# EAGLE schematic INV_H (EAGLE 9.6.2)
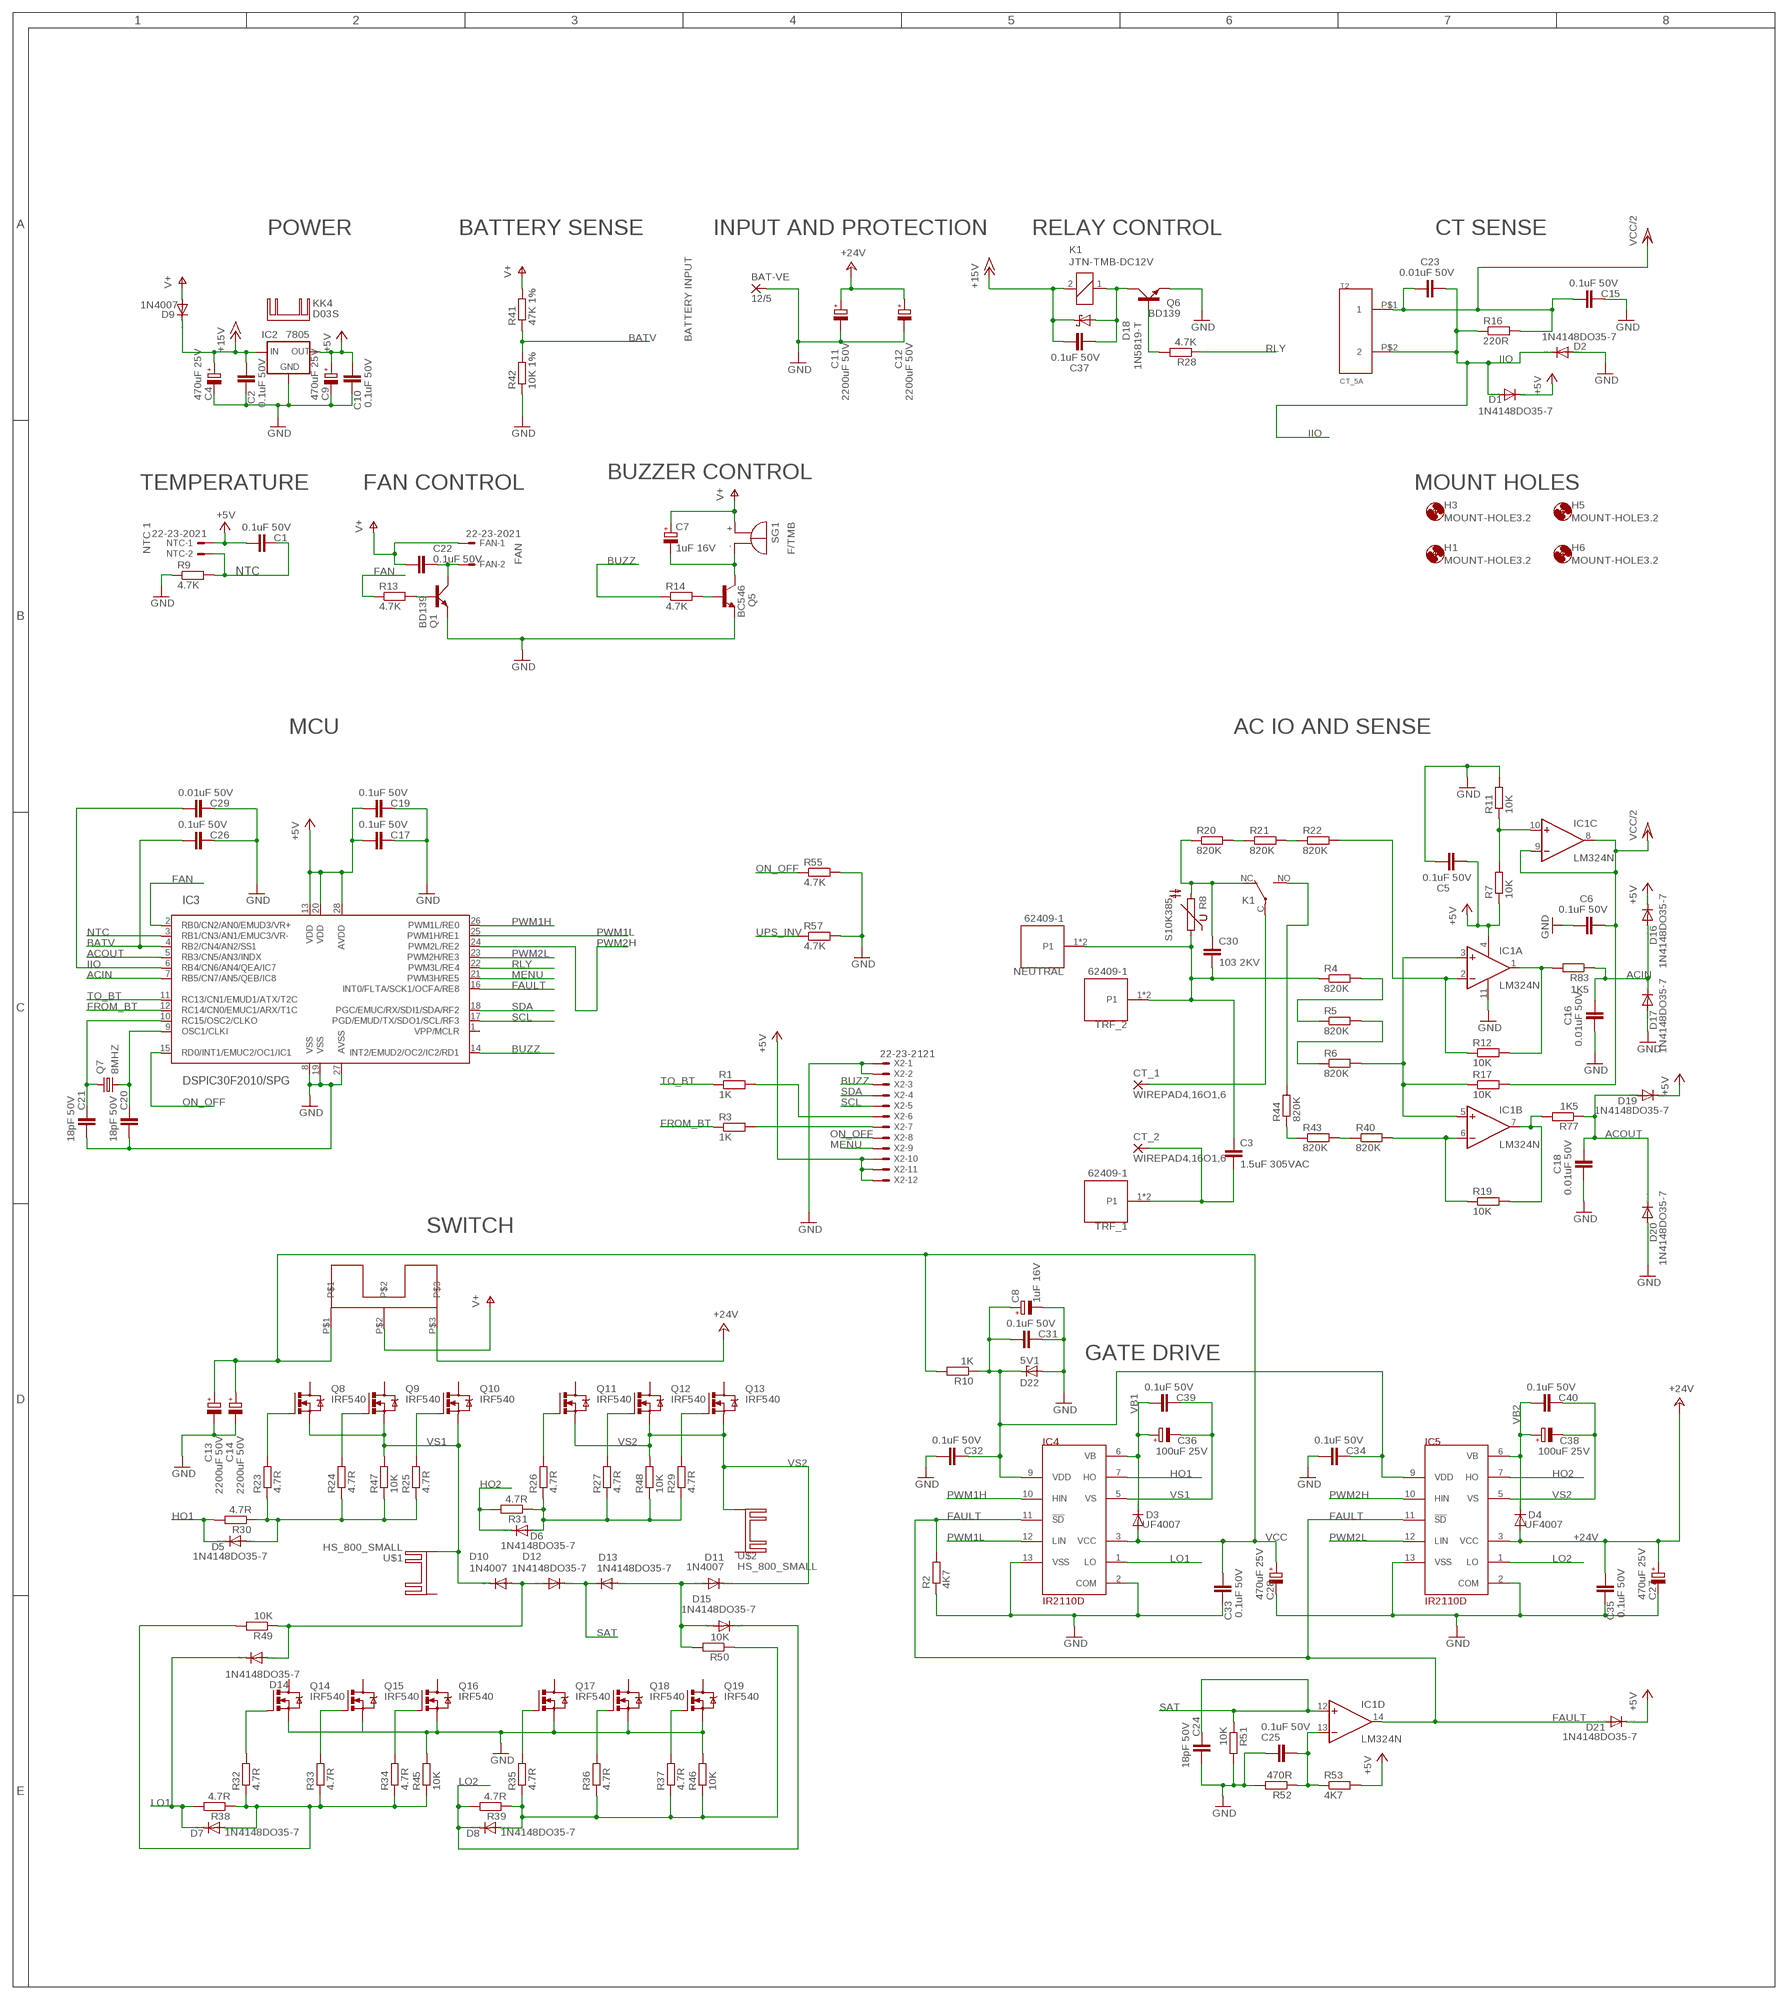
[diagram p0: schematic, sheet 1]

## Parts
BAT-VE  12/5  [8/5]
C1  0.1uF 50V  C-EU025-025X050  [C025-025X050]
C2  0.1uF 50V  C-EU025-025X050  [C025-025X050]
C3  1.5uF 305VAC  C-EU275-113X316  [C275-113X316]
C4  470uF 25V  CPOL-EUE3.5-8  [E3,5-8]
C5  0.1uF 50V  C-EU025-025X050  [C025-025X050]
C6  0.1uF 50V  C-EU025-025X050  [C025-025X050]
C7  1uF 16V  CPOL-EUE1.8-4  [E1,8-4]
C8  1uF 16V  CPOL-EUE1.8-4  [E1,8-4]
C9  470uF 25V  CPOL-EUE3.5-8  [E3,5-8]
C10  0.1uF 50V  C-EU025-025X050  [C025-025X050]
C11  2200uF 50V  CPOL-EUE7.5-16  [E7,5-16]
C12  2200uF 50V  CPOL-EUE7.5-16  [E7,5-16]
C13  2200uF 50V  CPOL-EUE7.5-16  [E7,5-16]
C14  2200uF 50V  CPOL-EUE7.5-16  [E7,5-16]
C15  0.1uF 50V  C-EU025-025X050  [C025-025X050]
C16  0.01uF 50V  C-EU025-025X050  [C025-025X050]
C17  0.1uF 50V  C-EU025-025X050  [C025-025X050]
C18  0.01uF 50V  C-EU025-025X050  [C025-025X050]
C19  0.1uF 50V  C-EU025-025X050  [C025-025X050]
C20  18pF 50V  C-EU025-025X050  [C025-025X050]
C21  18pF 50V  C-EU025-025X050  [C025-025X050]
C22  0.1uF 50V  C-EU025-025X050  [C025-025X050]
C23  0.01uF 50V  C-EU025-025X050  [C025-025X050]
C24  18pF 50V  C-EU025-025X050  [C025-025X050]
C25  0.1uF 50V  C-EU025-025X050  [C025-025X050]
C26  0.1uF 50V  C-EU025-025X050  [C025-025X050]
C27  470uF 25V  CPOL-EUE3.5-8  [E3,5-8]
C28  470uF 25V  CPOL-EUE3.5-8  [E3,5-8]
C29  0.01uF 50V  C-EU025-025X050  [C025-025X050]
C30  103 2KV  C-EU075-032X103  [C075-032X103]
C31  0.1uF 50V  C-EU025-025X050  [C025-025X050]
C32  0.1uF 50V  C-EU025-025X050  [C025-025X050]
C33  0.1uF 50V  C-EU025-025X050  [C025-025X050]
C34  0.1uF 50V  C-EU025-025X050  [C025-025X050]
C35  0.1uF 50V  C-EU025-025X050  [C025-025X050]
C36  100uF 25V  CPOL-EUE2.5-6  [E2,5-6]
C37  0.1uF 50V  C-EU025-025X050  [C025-025X050]
C38  100uF 25V  CPOL-EUE2.5-6  [E2,5-6]
C39  0.1uF 50V  C-EU025-025X050  [C025-025X050]
C40  0.1uF 50V  C-EU025-025X050  [C025-025X050]
CT_1  WIREPAD4,16O1,6  [4,16O1,6]
CT_2  WIREPAD4,16O1,6  [4,16O1,6]
D1  1N4148DO35-7  [DO35-7]
D2  1N4148DO35-7  [DO35-7]
D3  UF4007  1N4004  [DO41-10]
D4  UF4007  1N4004  [DO41-10]
D5  1N4148DO35-7  [DO35-7]
D6  1N4148DO35-7  [DO35-7]
D7  1N4148DO35-7  [DO35-7]
D8  1N4148DO35-7  [DO35-7]
D9  1N4007  1N4004  [DO41-10]
D10  1N4007  1N4004  [DO41-10]
D11  1N4007  1N4004  [DO41-10]
D12  1N4148DO35-7  [DO35-7]
D13  1N4148DO35-7  [DO35-7]
D14  1N4148DO35-7  [DO35-7]
D15  1N4148DO35-7  [DO35-7]
D16  1N4148DO35-7  [DO35-7]
D17  1N4148DO35-7  [DO35-7]
D18  1N5819-T  [DO41-7.6]
D19  1N4148DO35-7  [DO35-7]
D20  1N4148DO35-7  [DO35-7]
D21  1N4148DO35-7  [DO35-7]
D22  5V1  ZENER-DIODEDO34-7  [DO34Z7]
FAN  22-23-2021  [22-23-2021]
H1  MOUNT-HOLE3.2  [3,2]
H3  MOUNT-HOLE3.2  [3,2]
H5  MOUNT-HOLE3.2  [3,2]
H6  MOUNT-HOLE3.2  [3,2]
IC1  LM324N  [DIL14]
IC2  7805  78XXS  [78XXS]
IC3  DSPIC30F2010/SPG  [DIL28-3]
IC4  IR2110D  [DIL14]
IC5  IR2110D  [DIL14]
K1  JTN-TMB-DC12V  [JT-TMB]
KK4  D03S  [D03S]
KK5  HS_800_BIG  [800W_BIG]
NEUTRAL  62409-1  [TE_62409-1]
NTC  22-23-2021  [22-23-2021]
Q1  BD139  [TO126AV]
Q5  BC546  BC548  [TO92-EBC]
Q6  BD139  [TO126AV]
Q7  8MHZ  CRYSTALHC49S  [HC49/S]
Q8  IRF540  [TO220BV]
Q9  IRF540  [TO220BV]
Q10  IRF540  [TO220BV]
Q11  IRF540  [TO220BV]
Q12  IRF540  [TO220BV]
Q13  IRF540  [TO220BV]
Q14  IRF540  [TO220BV]
Q15  IRF540  [TO220BV]
Q16  IRF540  [TO220BV]
Q17  IRF540  [TO220BV]
Q18  IRF540  [TO220BV]
Q19  IRF540  [TO220BV]
R1  1K  R-EU_0204/7  [0204/7]
R2  4K7  R-EU_0204/7  [0204/7]
R3  1K  R-EU_0204/7  [0204/7]
R4  820K  R-EU_0204/7  [0204/7]
R5  820K  R-EU_0204/7  [0204/7]
R6  820K  R-EU_0204/7  [0204/7]
R7  10K  R-EU_0204/7  [0204/7]
R8  S10K385  [S10K385]
R9  4.7K  R-EU_0204/7  [0204/7]
R10  1K  R-EU_0204/7  [0204/7]
R11  10K  R-EU_0204/7  [0204/7]
R12  10K  R-EU_0204/7  [0204/7]
R13  4.7K  R-EU_0204/7  [0204/7]
R14  4.7K  R-EU_0204/7  [0204/7]
R16  220R  R-EU_0204/7  [0204/7]
R17  10K  R-EU_0204/7  [0204/7]
R19  10K  R-EU_0204/7  [0204/7]
R20  820K  R-EU_0204/7  [0204/7]
R21  820K  R-EU_0204/7  [0204/7]
R22  820K  R-EU_0204/7  [0204/7]
R23  4.7R  R-EU_0204/7  [0204/7]
R24  4.7R  R-EU_0204/7  [0204/7]
R25  4.7R  R-EU_0204/7  [0204/7]
R26  4.7R  R-EU_0204/7  [0204/7]
R27  4.7R  R-EU_0204/7  [0204/7]
R28  4.7K  R-EU_0204/7  [0204/7]
R29  4.7R  R-EU_0204/7  [0204/7]
R30  4.7R  R-EU_0204/7  [0204/7]
R31  4.7R  R-EU_0204/7  [0204/7]
R32  4.7R  R-EU_0204/7  [0204/7]
R33  4.7R  R-EU_0204/7  [0204/7]
R34  4.7R  R-EU_0204/7  [0204/7]
R35  4.7R  R-EU_0204/7  [0204/7]
R36  4.7R  R-EU_0204/7  [0204/7]
R37  4.7R  R-EU_0204/7  [0204/7]
R38  4.7R  R-EU_0204/7  [0204/7]
R39  4.7R  R-EU_0204/7  [0204/7]
R40  820K  R-EU_0204/7  [0204/7]
R41  47K 1%  R-EU_0204/7  [0204/7]
R42  10K 1%  R-EU_0204/7  [0204/7]
R43  820K  R-EU_0204/7  [0204/7]
R44  820K  R-EU_0204/7  [0204/7]
R45  10K  R-EU_0204/7  [0204/7]
R46  10K  R-EU_0204/7  [0204/7]
R47  10K  R-EU_0204/7  [0204/7]
R48  10K  R-EU_0204/7  [0204/7]
R49  10K  R-EU_0204/7  [0204/7]
R50  10K  R-EU_0204/7  [0204/7]
R51  10K  R-EU_0204/7  [0204/7]
R52  470R  R-EU_0204/7  [0204/7]
R53  4K7  R-EU_0204/7  [0204/7]
R55  4.7K  R-EU_0204/7  [0204/7]
R57  4.7K  R-EU_0204/7  [0204/7]
R77  1K5  R-EU_0204/7  [0204/7]
R83  1K5  R-EU_0204/7  [0204/7]
SG1  F/TMB  [F/TMB]
T2  CT_5A  [CT_5A]
TRF_1  62409-1  [TE_62409-1]
TRF_2  62409-1  [TE_62409-1]
U$1  HS_800_SMALL  [800W_SMALL]
U$2  HS_800_SMALL  [800W_SMALL]
X2  22-23-2121  [22-23-2121]

## Nets
+5V: C1.2 C5.2 C9.+ C10.2 C17.2 C19.2 D1.C D16.C D19.C D21.C IC1.4(P:V+) IC2.OUT IC3.13(VDD) IC3.20(VDD) IC3.28(AVDD) NTC.1 R7.3 R53.4 X2.10 X2.11 X2.12
+15V: C2.2 C4.+ C37.1 D9.C D18.C IC2.IN K1.2
+24V: C11.+ C12.+ C27.+ C35.2 D4.A IC5.3(VCC) KK5.P$3
ACIN: C16.1 D16.A D17.C IC3.7(RB5/CN7/AN5/QEB/IC8) R83.3
ACOUT: C18.1 D19.A D20.C IC3.5(RB3/CN5/AN3/INDX) R77.3
BATV: C26.2 IC3.4(RB2/CN4/AN2/SS1) R41.3 R42.4
BUZZ: IC3.14(INT2/EMUD2/OC2/IC2/RD1) R14.3 X2.3
FAN: IC3.2(RB0/CN2/AN0/EMUD3/VR+) R13.3
FAULT: D21.A IC1.14(D:OUT) IC3.16(INT0/FLTA/SCK1/OCFA/RE8) IC4.11(!SD) IC5.11(!SD) R2.4
FROM_BT: IC3.12(RC14/CN0/EMUC1/ARX/T1C) R3.3
GND: BAT-VE.P$1(P) C2.1 C4.- C5.1 C6.2 C8.- C9.- C10.1 C11.- C12.- C13.- C14.- C15.1 C16.2 C17.1 C18.2 C19.1 C20.2 C21.2 C24.2 C25.2 C26.1 C27.- C28.- C29.1 C31.1 C32.2 C33.1 C34.2 C35.1 D2.A D17.A D20.A D22.A IC1.11(P:V-) IC2.GND IC3.8(VSS) IC3.19(VSS) IC3.27(AVSS) IC4.2(COM) IC4.13(VSS) IC5.2(COM) IC5.13(VSS) Q1.E Q5.E Q6.E Q14.S Q15.S Q16.S Q17.S Q18.S Q19.S R2.3 R9.3 R11.4 R42.3 R45.4 R46.4 R51.4 R52.4 R55.4 R57.4 X2.1 X2.2
HO1: D5.C IC4.7(HO) R30.4
HO2: D6.C IC5.7(HO) R31.4
IIO: C23.1 C29.2 D1.A D2.C IC3.6(RB4/CN6/AN4/QEA/IC7) R16.3 T2.P$2
LO1: D7.C D14.C IC4.1(LO) R38.4
LO2: D8.C D15.C IC5.1(LO) R39.4
MENU: IC3.21(PWM3H/RE5) X2.9
N$3: C3.1 C30.2 NEUTRAL.1 NEUTRAL.2(P1) R4.3 R8.1 TRF_2.1 TRF_2.2(P1)
N$4: R3.4 X2.7
N$5: C3.2 CT_2.1(P) TRF_1.1 TRF_1.2(P1)
N$7: CT_1.1(P) K1.C(P)
N$8: C30.1 K1.NC(O) R8.2 R20.3
N$9: C25.1 IC1.13(D:-IN) R52.3 R53.3
N$10: IC1.10(C:+IN) R7.4 R11.3
N$12: R4.4 R5.3
N$13: C22.1 FAN.2 Q1.C
N$14: Q1.B R13.4
N$15: C7.- Q5.C SG1.-
N$16: Q5.B R14.4
N$17: R5.4 R6.3
N$18: C20.1 IC3.9(OSC1/CLKI) Q7.2
N$19: IC1.3(A:+IN) IC1.5(B:+IN) R6.4 R17.3
N$20: C21.1 IC3.10(RC15/OSC2/CLKO) Q7.1
N$21: IC1.2(A:-IN) R12.3 R22.4
N$22: D10.A D12.A D14.A R49.3
N$23: IC1.6(B:-IN) R19.3 R40.4
N$25: R20.4 R21.3
N$26: R21.4 R22.3
N$27: K1.NO(S) R44.4
N$28: R43.3 R44.3
N$29: Q8.G R23.4
N$30: Q9.G R24.4
N$31: Q10.G R25.4
N$32: D5.A R23.3 R24.3 R25.3 R30.3 R47.3
N$33: R40.3 R43.4
N$35: D7.A R32.3 R33.3 R34.3 R38.3 R45.3 R49.4
N$36: Q14.G R32.4
N$37: Q15.G R33.4
N$38: Q16.G R34.4
N$39: Q11.G R26.4
N$41: D6.A R26.3 R27.3 R29.3 R31.3 R48.3
N$45: D8.A R35.3 R36.3 R37.3 R39.3 R46.3 R50.3
N$46: C37.2 D18.A K1.1 Q6.C
N$47: Q17.G R35.4
N$48: Q6.B R28.4
N$49: Q18.G R36.4
N$51: Q19.G R37.4
N$52: Q13.G R29.4
N$53: Q12.G R27.4
N$57: D11.A D13.A D15.A R50.4
N$59: R1.4 X2.6
N$74: IC1.7(B:OUT) R19.4 R77.4
N$111: IC1.1(A:OUT) R12.4 R83.4
NTC: C1.1 IC3.3(RB1/CN3/AN1/EMUC3/VR-) NTC.2 R9.4
ON_OFF: IC3.15(RD0/INT1/EMUC2/OC1/IC1) R55.3 X2.8
PWM1H: IC3.26(PWM1L/RE0) IC4.10(HIN)
PWM1L: IC3.25(PWM1H/RE1) IC4.12(LIN)
PWM2H: IC3.24(PWM2L/RE2) IC5.10(HIN)
PWM2L: IC3.23(PWM2H/RE3) IC5.12(LIN)
RLY: IC3.22(PWM3L/RE4) R28.3
SAT: C24.1 D12.C D13.C IC1.12(D:+IN) R51.3
SCL: IC3.17(PGD/EMUD/TX/SDO1/SCL/RF3) X2.5
SDA: IC3.18(PGC/EMUC/RX/SDI1/SDA/RF2) X2.4
TO_BT: IC3.11(RC13/CN1/EMUD1/ATX/T2C) R1.3
UPS_INV: R57.3
V+: C7.+ C22.2 D9.A FAN.1 KK5.P$2 R41.4 SG1.+
VB1: C36.+ C39.2 D3.C IC4.6(VB)
VB2: C38.+ C40.2 D4.C IC5.6(VB)
VCC: C13.+ C14.+ C28.+ C33.2 D3.A IC4.3(VCC) KK5.P$1 R10.4
VCC/2: C6.1 C15.2 C23.2 IC1.8(C:OUT) IC1.9(C:-IN) R16.4 R17.4 T2.P$1
VDD: C8.+ C31.2 C32.1 C34.1 D22.C IC4.9(VDD) IC5.9(VDD) R10.3
VS1: C36.- C39.1 D10.C IC4.5(VS) Q8.S Q9.S Q10.S R47.4 U$1.P$2(K)
VS2: C38.- C40.1 D11.C IC5.5(VS) Q11.S Q12.S Q13.S R48.4 U$2.P$1(K)
Unconnected: IC3.1(VPP/MCLR) Q8.D Q9.D Q10.D Q11.D Q12.D Q13.D Q14.D Q15.D Q16.D Q17.D Q18.D Q19.D U$1.P$1(K) U$2.P$2(K)

## Notes on the sheet
- POWER | BATTERY SENSE | INPUT AND PROTECTION | RELAY CONTROL | CT SENSE
- BATTERY INPUT
- BUZZER CONTROL
- TEMPERATURE | FAN CONTROL | MOUNT HOLES
- NTC 1
- FAN
- MCU | AC IO AND SENSE
- SWITCH
- GATE DRIVE

## Library data of the parts
BAT-VE = wirepad:12/5
C1-C3 C5 C6 C10 C15-C26 C29-C35 C37 C39 C40 = resistor:C-EU: CAPACITOR, European symbol
C4 C7-C9 C11-C14 C27 C28 C36 C38 = resistor:CPOL-EU: POLARIZED CAPACITOR, European symbol
CT_1 CT_2 = wirepad:WIREPAD: Wire PAD connect wire on PCB
D1 D2 D5-D8 D12-D17 D19-D21 = diode:1N4148: DIODE high speed (Philips)
D3 D4 D9-D11 = diode:1N4004: DIODE general purpose rectifier, 1 A
D18 = diode:1N581*: 1.0A SCHOTTKY BARRIER RECTIFIER Source: http://www.diodes.com/datasheets/ds23001.pdf
D22 = diode:ZENER-DIODE: Z-Diode
FAN NTC = con-molex:22-23-2021: .100" (2.54mm) Center Header - 2 Pin; MF: MOLEX; MPN: 22-23-2021; OC_FARNELL: 1462926; OC_NEWARK: 25C3832
H1 H3 H5 H6 = holes:MOUNT-HOLE: MOUNTING HOLE with drill center marker
IC1 = linear:LM324: OP AMP
IC2 = v-reg:78XXS: VOLTAGE REGULATOR
IC3 = microchip-dspic:DSPIC30F2010: dsPIC Motion Controller DSC
IC4 IC5 = irs:IR2110
K1 = relay:JT?-*: COMPACT ECONOMICAL 30 AMP. RELAY NAiS Source: http://www.mew-europe.com/.. en_ds_61212_0000.pdf; OC_FARNELL: unknown; OC_NEWARK: unknown
KK4 = heatsink:D03S: HEATSINK distributor Schukat
KK5 = heatsink:HS_800_BIG
NEUTRAL TRF_1 TRF_2 = Spade_PCB:62409-1: CONN QC TAB 0.250 SOLDER Check prices <https://pricing.snapeda.com/parts/62409-1/TE%20Connectivity/view-part?ref=eda>; AVAILABILITY: In Stock; COMMENT: 62409-1; DESCRIPTION: Faston 20-16 AWG Straight Non-Insulated Printed Circuit Board Tab Terminal; EU_ROHS_COMPLIANCE: Compliant; MF: TE Connectivity; MP: 62409-1; PACKAGE: None; PRICE: None; PURCHASE-URL: https://pricing.snapeda.com/search/part/62409-1/?ref=eda
Q1 Q6 = transistor-power:BD139: NPN TRANSISTOR
Q5 = transistor-npn:BC548*: NPN Transistor
Q7 = crystal:CRYSTAL: CRYSTAL; OC_FARNELL: 1667008; OC_NEWARK: unknown
Q8-Q19 = transistor-power:IRF540: HEXFET Power MOSFET
R1-R7 R9-R14 R16 R17 R19-R53 R55 R57 R77 R83 = resistor:R-EU_: RESISTOR, European symbol
R8 = varistor:S10K385: VARISTOR
SG1 = buzzer:F/TMB: BUZZER Source: Buerklin; OC_FARNELL: unknown; OC_NEWARK: unknown
T2 = trafo:CT_5A
U$1 U$2 = heatsink:HS_800_SMALL
X2 = con-molex:22-23-2121: .100" (2.54mm) Center Header - 12 Pin; MF: MOLEX; MPN: 22-23-2121; OC_FARNELL: 1462935; OC_NEWARK: 56H0456